# Altium schematic sheet TPS522362-PJ316A-6A.schdoc
size A2
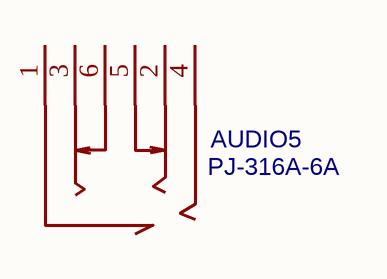
[diagram p0: TPS522362-PJ316A-6A.schdoc]

## Parts
AUDIO5  PJ-316A-6A  [PJ-316A-6A]

## Nets

Not connected (* = marked no-connect by the designer): AUDIO5 1 2 3 4 5 6

## Library data of the parts
AUDIO5 = PJ-316A-6A: BOM_Manufacturer: HRO; Manufacturer 1: HRO Electronics; Contributor: LCSC; BOM_Supplier: LCSC; BOM_Manufacturer Part: PJ-316A-6A; BOM_Supplier Part: C128987; spicePre: A; Supplier 1: LCSC; Supplier Part Number 1: C128987; Manufacturer Part Number 1: PJ-316A-6A; Stock 1: 6091; Pricing 1: 1=0.2891, 10=0.2162, 30=0.2027, 100=0.1893, 500=0.1834, 1000=0.1804, 1=0.2697, 10=0.2016, 30=0.1891, 100=0.1766, 500=0.171, 1000=0.1683, 1=1.3646, 10=1.0202, 30=0.9569, 100=0.8936, 500=0.8654, 1000=0.8515, 1=1.3049, 10=0.9755, 30=0.9149, 100=0.8544, 500=0.8275, 1000=0.8142, 1=0.1752, 10=0.131, 30=0.1229, 100=0.1147, 500=0.1111, 1000=0.1093, 1=0.1579, 10=0.118, 30=0.1107, 100=0.1034, 500=0.1001, 1000=0.0985, 1=1.5823, 10=1.1829, 30=1.1095, 100=1.0361, 500=1.0035, 1000=0.9873, 1=21.3783, 10=15.982, 30=14.9903, 100=13.9984, 500=13.5574, 1000=13.3397, 1=0.8481, 10=0.634, 30=0.5947, 100=0.5553, 500=0.5378, 1000=0.5292, 1=16.4487, 10=12.2967, 30=11.5336, 100=10.7705, 500=10.4312, 1000=10.2637, 1=1.8173, 10=1.3586, 30=1.2743, 100=1.19, 500=1.1525, 1000=1.134, 1=0.2784, 10=0.2081, 30=0.1952, 100=0.1823, 500=0.1765, 1000=0.1737, 1=0.20414, 10=0.15261, 30=0.14314, 100=0.13367, 500=0.12946, 1000=0.12738 (AUD)